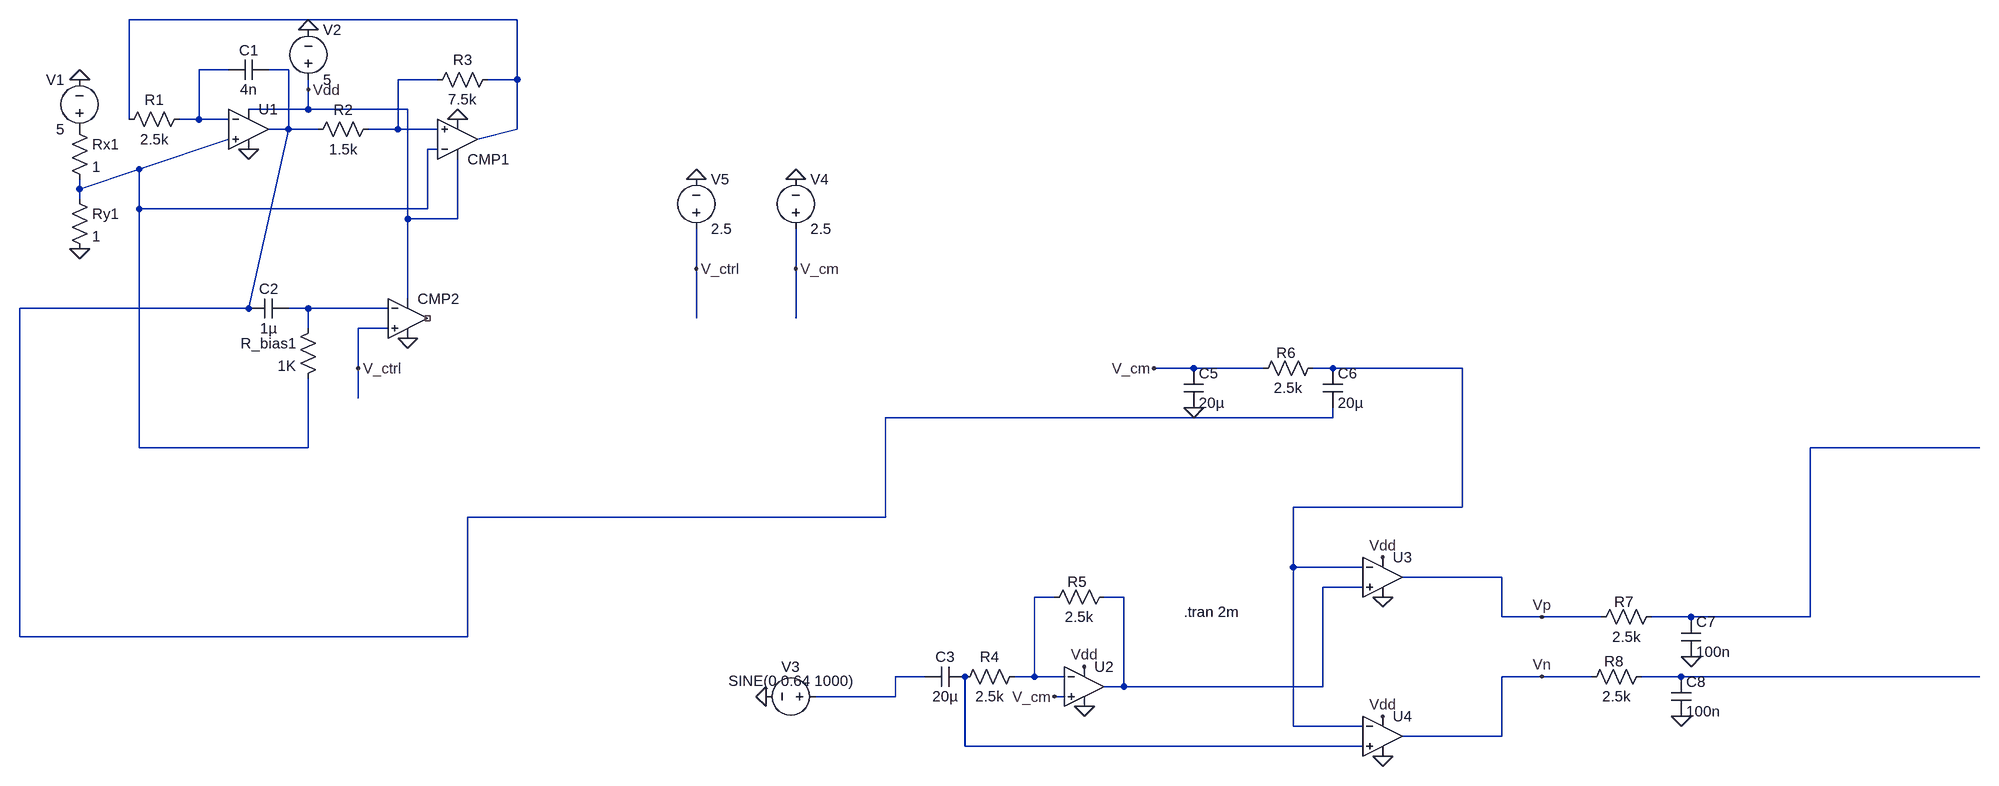
[diagram p0: schematic Class_d amp.asc]
Class_d amp.asc, the LTspice schematic file:
Version 4
SHEET 1 5316 1936
WIRE 800 80 176 80
WIRE 336 160 288 160
WIRE 432 160 400 160
WIRE 672 176 608 176
WIRE 800 176 800 80
WIRE 800 176 752 176
WIRE 464 192 464 176
WIRE 464 224 464 192
WIRE 464 224 368 224
WIRE 624 224 464 224
WIRE 176 240 176 80
WIRE 288 240 288 160
WIRE 288 240 256 240
WIRE 336 240 288 240
WIRE 432 256 432 160
WIRE 432 256 400 256
WIRE 480 256 432 256
WIRE 608 256 608 176
WIRE 608 256 560 256
WIRE 672 256 608 256
WIRE 800 256 800 176
WIRE 736 272 800 256
WIRE 672 288 656 288
WIRE 192 320 336 272
WIRE 96 352 192 320
WIRE 96 352 96 336
WIRE 96 368 96 352
WIRE 192 384 192 320
WIRE 656 384 656 288
WIRE 656 384 192 384
WIRE 624 400 624 224
WIRE 704 400 704 304
WIRE 704 400 624 400
WIRE 1088 480 1088 416
WIRE 1248 480 1248 416
WIRE 624 528 624 400
WIRE 368 544 432 256
WIRE 368 544 0 544
WIRE 464 544 432 544
WIRE 592 544 464 544
WIRE 1088 560 1088 480
WIRE 1248 560 1248 480
WIRE 464 576 464 544
WIRE 592 576 544 576
WIRE 544 640 544 576
WIRE 1888 640 1824 640
WIRE 2000 640 1888 640
WIRE 2112 640 2080 640
WIRE 2320 640 2112 640
WIRE 544 688 544 640
WIRE 2112 720 2112 704
WIRE 2112 720 1392 720
WIRE 192 768 192 384
WIRE 464 768 464 656
WIRE 464 768 192 768
WIRE 3152 768 2880 768
WIRE 2320 864 2320 640
WIRE 2320 864 2048 864
WIRE 1392 880 1392 720
WIRE 1392 880 720 880
WIRE 2048 960 2048 864
WIRE 2160 960 2048 960
WIRE 2384 976 2224 976
WIRE 2160 992 2096 992
WIRE 1664 1008 1632 1008
WIRE 1776 1008 1744 1008
WIRE 2384 1040 2384 976
WIRE 2448 1040 2384 1040
WIRE 2544 1040 2448 1040
WIRE 2688 1040 2624 1040
WIRE 2880 1040 2880 768
WIRE 2880 1040 2688 1040
WIRE 0 1072 0 544
WIRE 720 1072 720 880
WIRE 720 1072 0 1072
WIRE 1456 1136 1408 1136
WIRE 1632 1136 1632 1008
WIRE 1632 1136 1600 1136
WIRE 1680 1136 1632 1136
WIRE 2448 1136 2384 1136
WIRE 2528 1136 2448 1136
WIRE 2672 1136 2608 1136
WIRE 3152 1136 2672 1136
WIRE 1776 1152 1776 1008
WIRE 1776 1152 1744 1152
WIRE 2096 1152 2096 992
WIRE 2096 1152 1776 1152
WIRE 1408 1168 1408 1136
WIRE 1408 1168 1280 1168
WIRE 1680 1168 1664 1168
WIRE 2048 1216 2048 960
WIRE 2160 1216 2048 1216
WIRE 2384 1232 2384 1136
WIRE 2384 1232 2224 1232
WIRE 1520 1248 1520 1136
WIRE 2160 1248 1520 1248
FLAG 96 176 0
FLAG 96 448 0
FLAG 464 96 0
FLAG 368 288 0
FLAG 624 592 0
FLAG 704 240 0
FLAG 544 640 V_ctrl
FLAG 1088 336 0
FLAG 1088 480 V_ctrl
FLAG 1712 1184 0
FLAG 464 192 Vdd
FLAG 1712 1120 Vdd
FLAG 1664 1168 V_cm
FLAG 1200 1168 0
FLAG 2192 1008 0
FLAG 2192 1264 0
FLAG 2192 944 Vdd
FLAG 2192 1200 Vdd
FLAG 2448 1040 Vp
FLAG 2448 1136 Vn
FLAG 1888 704 0
FLAG 1824 640 V_cm
FLAG 1248 336 0
FLAG 1248 480 V_cm
FLAG 2688 1104 0
FLAG 2672 1200 0
SYMBOL voltage 96 272 R180
WINDOW 0 24 96 Left 2
WINDOW 3 24 16 Left 2
SYMATTR InstName V1
SYMATTR Value 5
SYMBOL res 80 240 R0
SYMATTR InstName Rx1
SYMATTR Value 1
SYMBOL res 80 352 R0
SYMATTR InstName Ry1
SYMATTR Value 1
SYMBOL res 272 224 R90
WINDOW 0 0 56 VBottom 2
WINDOW 3 32 56 VTop 2
SYMATTR InstName R1
SYMATTR Value 2.5k
SYMBOL res 576 240 R90
WINDOW 0 0 56 VBottom 2
WINDOW 3 32 56 VTop 2
SYMATTR InstName R2
SYMATTR Value 1.5k
SYMBOL res 768 160 R90
WINDOW 0 0 56 VBottom 2
WINDOW 3 32 56 VTop 2
SYMATTR InstName R3
SYMATTR Value 7.5k
SYMBOL cap 336 176 R270
WINDOW 0 32 32 VTop 2
WINDOW 3 0 32 VBottom 2
SYMATTR InstName C1
SYMATTR Value 4n
SYMBOL cap 432 528 R90
WINDOW 0 0 32 VBottom 2
WINDOW 3 32 32 VTop 2
SYMATTR InstName C2
SYMATTR Value 1µ
SYMBOL voltage 464 192 M180
WINDOW 0 24 96 Left 2
WINDOW 3 24 16 Left 2
SYMATTR InstName V2
SYMATTR Value 5
SYMBOL res 480 560 M0
SYMATTR InstName R_bias1
SYMATTR Value 1K
SYMBOL UniversalOpamp2 704 272 M180
SYMATTR InstName CMP1
SYMBOL UniversalOpamp2 624 560 R0
SYMATTR InstName CMP2
SYMBOL UniversalOpamp2 368 256 R0
SYMATTR InstName U1
SYMBOL voltage 1088 432 M180
WINDOW 0 24 96 Left 2
WINDOW 3 24 16 Left 2
SYMATTR InstName V5
SYMATTR Value 2.5
SYMBOL res 1616 1120 R90
WINDOW 0 0 56 VBottom 2
WINDOW 3 32 56 VTop 2
SYMATTR InstName R4
SYMATTR Value 2.5k
SYMBOL cap 1456 1152 R270
WINDOW 0 32 32 VTop 2
WINDOW 3 0 32 VBottom 2
SYMATTR InstName C3
SYMATTR Value 20µ
SYMBOL UniversalOpamp2 1712 1152 R0
SYMATTR InstName U2
SYMBOL res 1760 992 R90
WINDOW 0 7 60 VBottom 2
WINDOW 3 32 56 VTop 2
SYMATTR InstName R5
SYMATTR Value 2.5k
SYMBOL voltage 1296 1168 R90
WINDOW 0 -32 56 VBottom 2
WINDOW 3 -10 56 VBottom 2
SYMATTR InstName V3
SYMATTR Value SINE(0 0.64 1000)
SYMBOL UniversalOpamp2 2192 976 R0
SYMATTR InstName U3
SYMBOL UniversalOpamp2 2192 1232 R0
SYMATTR InstName U4
SYMBOL cap 1872 640 R0
SYMATTR InstName C5
SYMATTR Value 20µ
SYMBOL res 2096 624 R90
WINDOW 0 7 60 VBottom 2
WINDOW 3 32 56 VTop 2
SYMATTR InstName R6
SYMATTR Value 2.5k
SYMBOL cap 2096 640 R0
SYMATTR InstName C6
SYMATTR Value 20µ
SYMBOL voltage 1248 432 M180
WINDOW 0 24 96 Left 2
WINDOW 3 24 16 Left 2
SYMATTR InstName V4
SYMATTR Value 2.5
SYMBOL res 2640 1024 R90
WINDOW 0 7 60 VBottom 2
WINDOW 3 32 56 VTop 2
SYMATTR InstName R7
SYMATTR Value 2.5k
SYMBOL cap 2672 1040 R0
SYMATTR InstName C7
SYMATTR Value 100n
SYMBOL res 2624 1120 R90
WINDOW 0 7 60 VBottom 2
WINDOW 3 32 56 VTop 2
SYMATTR InstName R8
SYMATTR Value 2.5k
SYMBOL cap 2656 1136 R0
SYMATTR InstName C8
SYMATTR Value 100n
TEXT 1872 1032 Left 2 !.tran 2m

The netlist it stands for:
* Class_d amp.asc
V1 P001 0 5
Rx1 P001 N005 1
Ry1 N005 0 1
R1 N002 N001 2.5k
R2 N004 N003 1.5k
R3 N001 N004 7.5k
C1 N002 N003 4n
C2 N006 N003 1µ
V2 Vdd 0 5
R_bias1 N006 N005 1K
XCMP1 N004 N005 Vdd 0 N001 level.2 Avol=1Meg GBW=10Meg Slew=10Meg ilimit=25m rail=0 Vos=0 phimargin=45 en=0 enk=0 in=0 ink=0 Rin=500Meg  ; pins IN+ IN- V+ V- OUT
XCMP2 V_ctrl N006 Vdd 0 NC_01 level.2 Avol=1Meg GBW=10Meg Slew=10Meg ilimit=25m rail=0 Vos=0 phimargin=45 en=0 enk=0 in=0 ink=0 Rin=500Meg  ; pins IN+ IN- V+ V- OUT
XU1 N005 N002 Vdd 0 N003 level.2 Avol=1Meg GBW=10Meg Slew=10Meg ilimit=25m rail=0 Vos=0 phimargin=45 en=0 enk=0 in=0 ink=0 Rin=500Meg  ; pins IN+ IN- V+ V- OUT
V5 V_ctrl 0 2.5
R4 N010 N013 2.5k
C3 N011 N013 20µ
XU2 V_cm N010 Vdd 0 N009 level.2 Avol=1Meg GBW=10Meg Slew=10Meg ilimit=25m rail=0 Vos=0 phimargin=45 en=0 enk=0 in=0 ink=0 Rin=500Meg  ; pins IN+ IN- V+ V- OUT
R5 N009 N010 2.5k
V3 N011 0 SINE(0 0.64 1000)
XU3 N009 N007 Vdd 0 Vp level.2 Avol=1Meg GBW=10Meg Slew=10Meg ilimit=25m rail=0 Vos=0 phimargin=45 en=0 enk=0 in=0 ink=0 Rin=500Meg  ; pins IN+ IN- V+ V- OUT
XU4 N013 N007 Vdd 0 Vn level.2 Avol=1Meg GBW=10Meg Slew=10Meg ilimit=25m rail=0 Vos=0 phimargin=45 en=0 enk=0 in=0 ink=0 Rin=500Meg  ; pins IN+ IN- V+ V- OUT
C5 V_cm 0 20µ
R6 N007 V_cm 2.5k
C6 N007 N003 20µ
V4 V_cm 0 2.5
R7 N008 Vp 2.5k
C7 N008 0 100n
R8 N012 Vn 2.5k
C8 N012 0 100n
.tran 2m
.lib UniversalOpamps2.sub
.backanno
.end